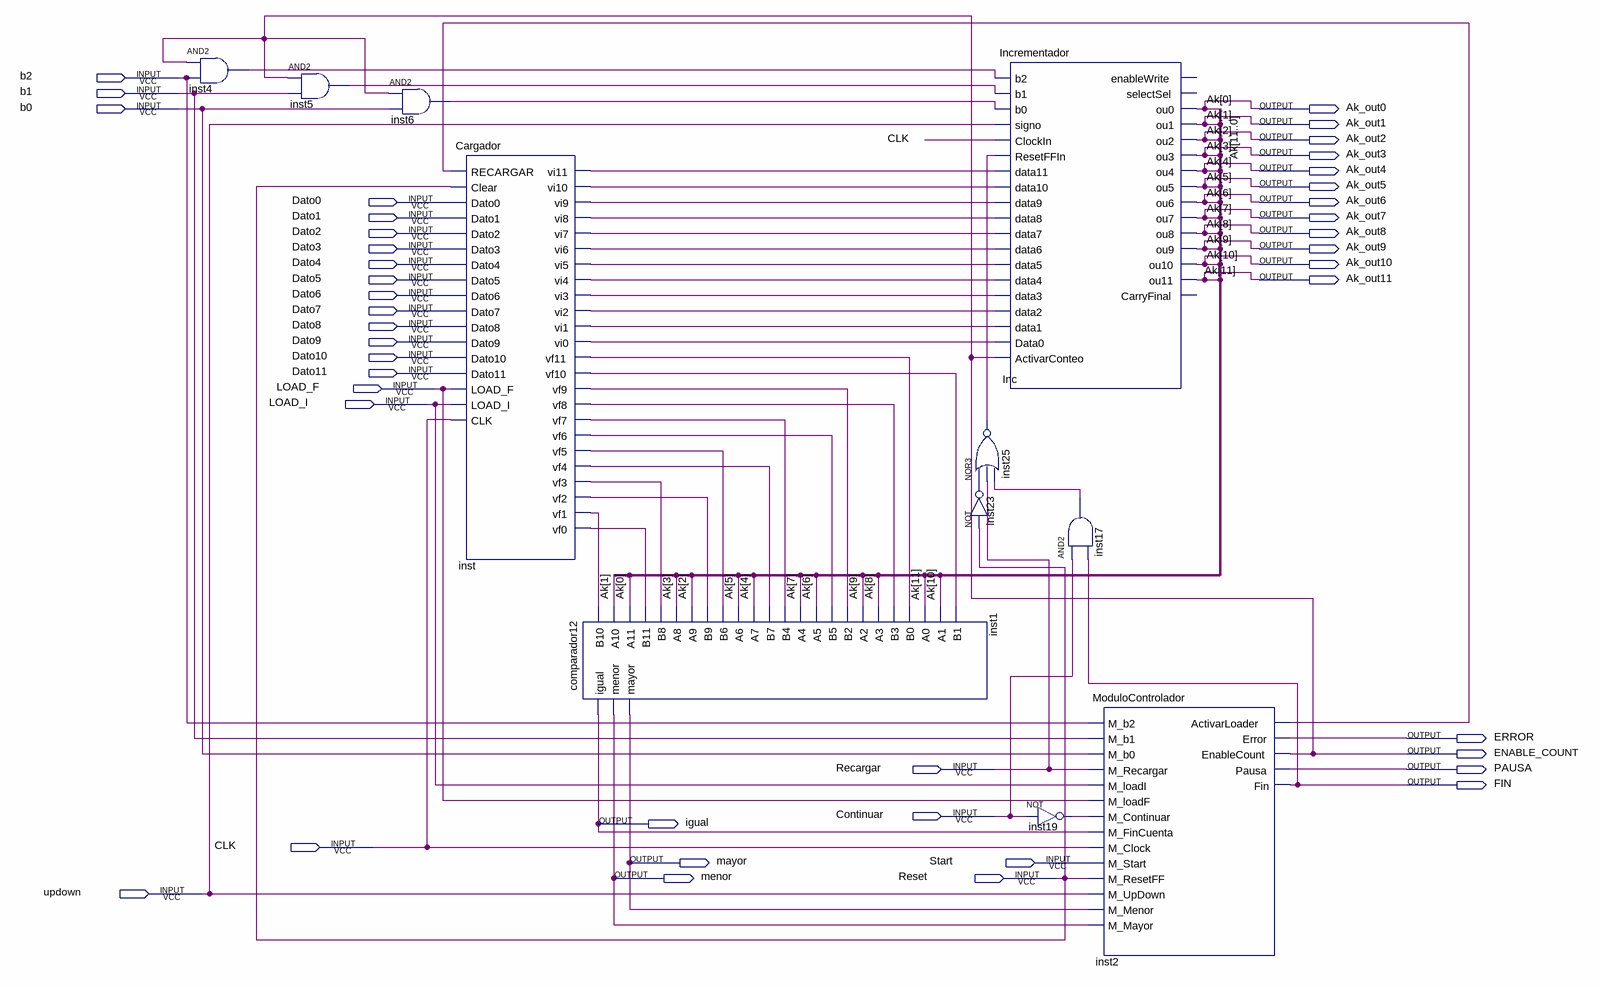
[diagram p0: schematic sheet]
// Quartus schematic main.bdf as structural Verilog: 11 symbols, 42 pins
module main (
  input  b2,
  input  b1,
  input  b0,
  input  Dato0,
  input  Dato1,
  input  Dato2,
  input  Dato3,
  input  Dato4,
  input  Dato5,
  input  Dato6,
  input  Dato7,
  input  Dato8,
  input  Dato9,
  input  Dato10,
  input  Dato11,
  input  LOAD_F,
  input  LOAD_I,
  input  Recargar,
  input  Continuar,
  input  CLK,
  input  Start,
  input  Reset,
  input  updown,
  output Ak_out0,
  output Ak_out1,
  output Ak_out2,
  output Ak_out3,
  output Ak_out4,
  output Ak_out5,
  output Ak_out6,
  output Ak_out7,
  output Ak_out8,
  output Ak_out9,
  output Ak_out10,
  output Ak_out11,
  output ERROR,
  output ENABLE_COUNT,
  output PAUSA,
  output FIN,
  output igual,
  output mayor,
  output menor
);

  wire inst2_activarloader, inst4_out, inst5_out, inst6_out, inst17_out, inst19_out, inst23_out, inst25_out,
       inst_vf0, inst_vf1, inst_vf2, inst_vf3, inst_vf4, inst_vf5, inst_vf6, inst_vf7, inst_vf8, inst_vf9,
       inst_vf10, inst_vf11, inst_vi0, inst_vi1, inst_vi2, inst_vi3, inst_vi4, inst_vi5, inst_vi6, inst_vi7,
       inst_vi8, inst_vi9, inst_vi10, inst_vi11;

  and inst4 (inst4_out, ENABLE_COUNT, b2);
  and inst5 (inst5_out, ENABLE_COUNT, b1);
  and inst6 (inst6_out, ENABLE_COUNT, b0);
  Cargador inst (
    .CLK(CLK), .Clear(Reset), .RECARGAR(inst2_activarloader), .LOAD_I(LOAD_I), .Dato0(Dato0), .Dato1(Dato1),
    .Dato2(Dato2), .Dato3(Dato3), .Dato4(Dato4), .Dato5(Dato5), .Dato6(Dato6), .Dato7(Dato7), .Dato8(Dato8),
    .Dato9(Dato9), .Dato10(Dato10), .Dato11(Dato11), .LOAD_F(LOAD_F), .vi11(inst_vi11), .vi10(inst_vi10),
    .vi9(inst_vi9), .vi8(inst_vi8), .vi7(inst_vi7), .vi6(inst_vi6), .vi5(inst_vi5), .vi4(inst_vi4),
    .vi3(inst_vi3), .vi2(inst_vi2), .vi1(inst_vi1), .vi0(inst_vi0), .vf11(inst_vf11), .vf10(inst_vf10),
    .vf9(inst_vf9), .vf8(inst_vf8), .vf7(inst_vf7), .vf6(inst_vf6), .vf5(inst_vf5), .vf4(inst_vf4),
    .vf3(inst_vf3), .vf2(inst_vf2), .vf1(inst_vf1), .vf0(inst_vf0));
  comparador12 inst1 (
    .B10(inst_vf1), .A10(Ak_out1), .A11(Ak_out0), .B11(inst_vf0), .B8(inst_vf3), .A8(Ak_out3), .A9(Ak_out2),
    .B9(inst_vf2), .B6(inst_vf5), .A6(Ak_out5), .A7(Ak_out4), .B7(inst_vf4), .B4(inst_vf7), .A4(Ak_out7),
    .A5(Ak_out6), .B5(inst_vf6), .B2(inst_vf9), .A2(Ak_out9), .A3(Ak_out8), .B3(inst_vf8), .B0(inst_vf11),
    .A0(Ak_out11), .A1(Ak_out10), .B1(inst_vf10), .igual(igual), .menor(menor), .mayor(mayor));
  Incrementador Inc (
    .b2(inst4_out), .b1(inst5_out), .ActivarConteo(ENABLE_COUNT), .b0(inst6_out), .ClockIn(CLK),
    .ResetFFIn(inst25_out), .Data0(inst_vi0), .data1(inst_vi1), .data2(inst_vi2), .data3(inst_vi3),
    .data4(inst_vi4), .data5(inst_vi5), .data6(inst_vi6), .data7(inst_vi7), .data8(inst_vi8),
    .data9(inst_vi9), .data10(inst_vi10), .data11(inst_vi11), .signo(updown), .ou0(Ak_out0), .ou1(Ak_out1),
    .ou2(Ak_out2), .ou3(Ak_out3), .ou4(Ak_out4), .ou5(Ak_out5), .ou6(Ak_out6), .ou7(Ak_out7), .ou8(Ak_out8),
    .ou9(Ak_out9), .ou10(Ak_out10), .ou11(Ak_out11));  // open: enableWrite, selectSel, CarryFinal
  nor inst25 (inst25_out, inst23_out, Recargar, inst17_out);
  not inst23 (inst23_out, Reset);
  and inst17 (inst17_out, Continuar, FIN);
  not inst19 (inst19_out, Continuar);
  ModuloControlador inst2 (
    .M_b2(b2), .M_b1(b1), .M_b0(b0), .M_Recargar(Recargar), .M_loadI(LOAD_I), .M_loadF(LOAD_F),
    .M_Continuar(inst19_out), .M_FinCuenta(igual), .M_Clock(CLK), .M_Start(Start), .M_ResetFF(Reset),
    .M_UpDown(updown), .M_Mayor(menor), .M_Menor(mayor), .ActivarLoader(inst2_activarloader), .Error(ERROR),
    .EnableCount(ENABLE_COUNT), .Pausa(PAUSA), .Fin(FIN));

  // Other names for the same wires on the sheet: Ak[11:0] = {Ak_out11, Ak_out10, Ak_out9, Ak_out8, Ak_out7, Ak_out6, Ak_out5, Ak_out4, Ak_out3, Ak_out2, Ak_out1, Ak_out0}
endmodule
